# EAGLE design main (EAGLE 7.1.0)
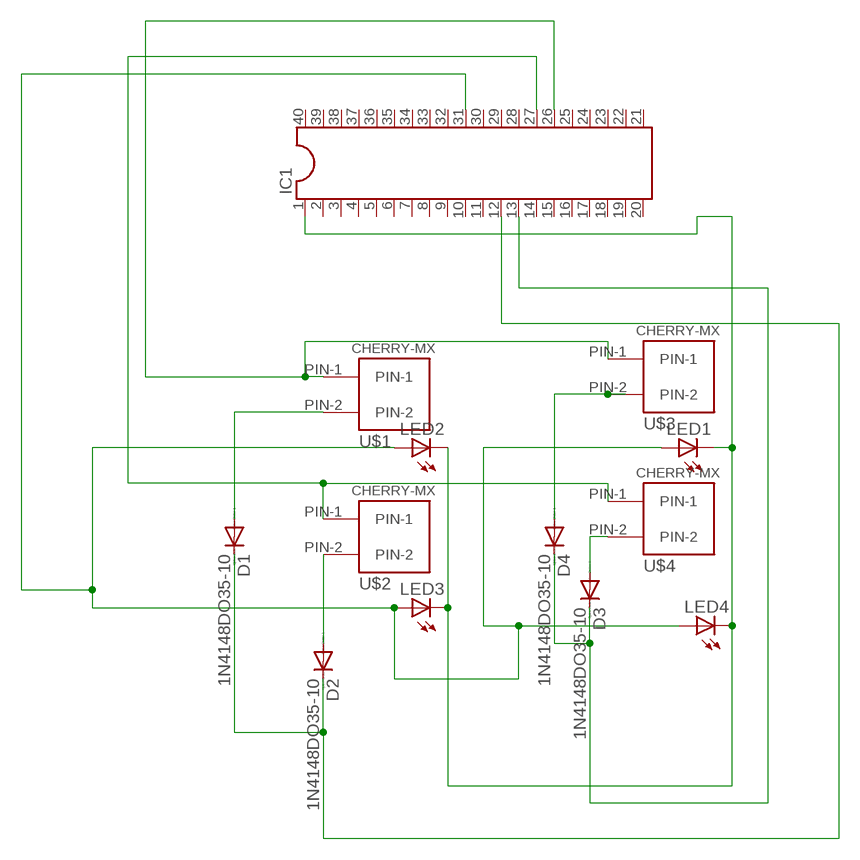
[diagram p0: schematic, sheet 1]

## Parts
D1  1N4148DO35-10  [DO35-10]
D2  1N4148DO35-10  [DO35-10]
D3  1N4148DO35-10  [DO35-10]
D4  1N4148DO35-10  [DO35-10]
IC1  DIL40  [DIL40]
LED1  LED3MM  [LED3MM]
LED2  LED3MM  [LED3MM]
LED3  LED3MM  [LED3MM]
LED4  LED3MM  [LED3MM]
U$1  CHERRY-MX-I  [CHERRY-MX-I]
U$2  CHERRY-MX-I  [CHERRY-MX-I]
U$3  CHERRY-MX-I  [CHERRY-MX-I]
U$4  CHERRY-MX-I  [CHERRY-MX-I]

## Nets
N$1: D1.A U$1.PIN-2
N$2: D2.A U$2.PIN-2
N$3: D4.A U$3.PIN-2
N$4: D3.A U$4.PIN-2
N$6: D3.C D4.C IC1.13
N$7: IC1.27 U$2.PIN-1 U$4.PIN-1
N$8: IC1.26 U$1.PIN-1 U$3.PIN-1
N$10: D1.C D2.C IC1.12
N$11: IC1.1 LED1.K(C) LED2.K(C) LED3.K(C) LED4.K(C)
N$12: IC1.31 LED1.A LED2.A LED3.A LED4.A
Unconnected: IC1.2 IC1.3 IC1.4 IC1.5 IC1.6 IC1.7 IC1.8 IC1.9 IC1.10 IC1.11 IC1.14 IC1.15 IC1.16 IC1.17 IC1.18 IC1.19 IC1.20 IC1.21 IC1.22 IC1.23 IC1.24 IC1.25 IC1.28 IC1.29 IC1.30 IC1.32 IC1.33 IC1.34 IC1.35 IC1.36 IC1.37 IC1.38 IC1.39 IC1.40

## Library data of the parts
D1-D4 = diode:1N4148: DIODE high speed (Philips)
IC1 = ic-package:DIL40: Dual In Line
LED1-LED4 = led:LED: LED OSRAM: - CHIPLED LG R971, LG N971, LY N971, LG Q971, LY Q971, LO R971, LY R971 LH N974, LH R974 LS Q976, LO Q976, LY Q976 LO Q996 - Hyper CHIPLED LW Q18S LB Q993, LB Q99A, LB R99A - SideLED LS A670, LO A670, LY A670, LG A670, LP A670 LB A673, LV A673, LT A673, LW A673 LH A674 LY A675 LS A676, LA A676, LO A676, LY A676, LW A676 LS A679, LY A679, LG A679 - Hyper Micro SIDELED® LS Y876, LA Y876, LO Y876, LY Y876 LT Y87S - SmartLED LW L88C, LW L88S LB L89C, LB L89S, LG L890 LS L89K, LO L89K, LY L89K LS L896, LA L896, LO L896, LY L896 - TOPLED LS T670, LO T670, LY T670, LG T670, LP T670 LSG T670, LSP T670, LSY T670, LOP T670, LYG T670 LG T671, LOG T671, LSG T671 LB T673, LV T673, LT T673, LW T673 LH T674 LS T676, LA T676, LO T676, LY T676, LB T676, LH T676, LSB T676, LW T676 LB T67C, LV T67C, LT T67C, LS T67K, LO T67K, LY T67K, LW E67C LS E67B, LA E67B, LO E67B, LY E67B, LB E67C, LV E67C, LT E67C LW T67C LS T679, LY T679, LG T679 LS T770, LO T770, LY T770, LG T770, LP T770 LB T773, LV T773, LT T773, LW T773 LH T774 LS E675, LA E675, LY E675, LS T675 LS T776, LA T776, LO T776, LY T776, LB T776 LHGB T686 LT T68C, LB T68C - Hyper Mini TOPLED® LB M676 - Mini TOPLED Santana® LG M470 LS M47K, LO M47K, LY M47K Source: http://www.osram.convergy.de LUXEON: - LUMILED® LXK2-PW12-R00, LXK2-PW12-S00, LXK2-PW14-U00, LXK2-PW14-V00 LXK2-PM12-R00, LXK2-PM12-S00, LXK2-PM14-U00 LXK2-PE12-Q00, LXK2-PE12-R00, LXK2-PE12-S00, LXK2-PE14-T00, LXK2-PE14-U00 LXK2-PB12-K00, LXK2-PB12-L00, LXK2-PB12-M00, LXK2-PB14-N00, LXK2-PB14-P00, LXK2-PB14-Q00 LXK2-PR12-L00, LXK2-PR12-M00, LXK2-PR14-Q00, LXK2-PR14-R00 LXK2-PD12-Q00, LXK2-PD12-R00, LXK2-PD12-S00 LXK2-PH12-R00, LXK2-PH12-S00 LXK2-PL12-P00, LXK2-PL12-Q00, LXK2-PL12-R00 Source: www.luxeon.com KINGBRIGHT: KA-3528ASYC Source: www.kingbright.com
U$1-U$4 = cherrymx:CHERRY-MX-I

## Board
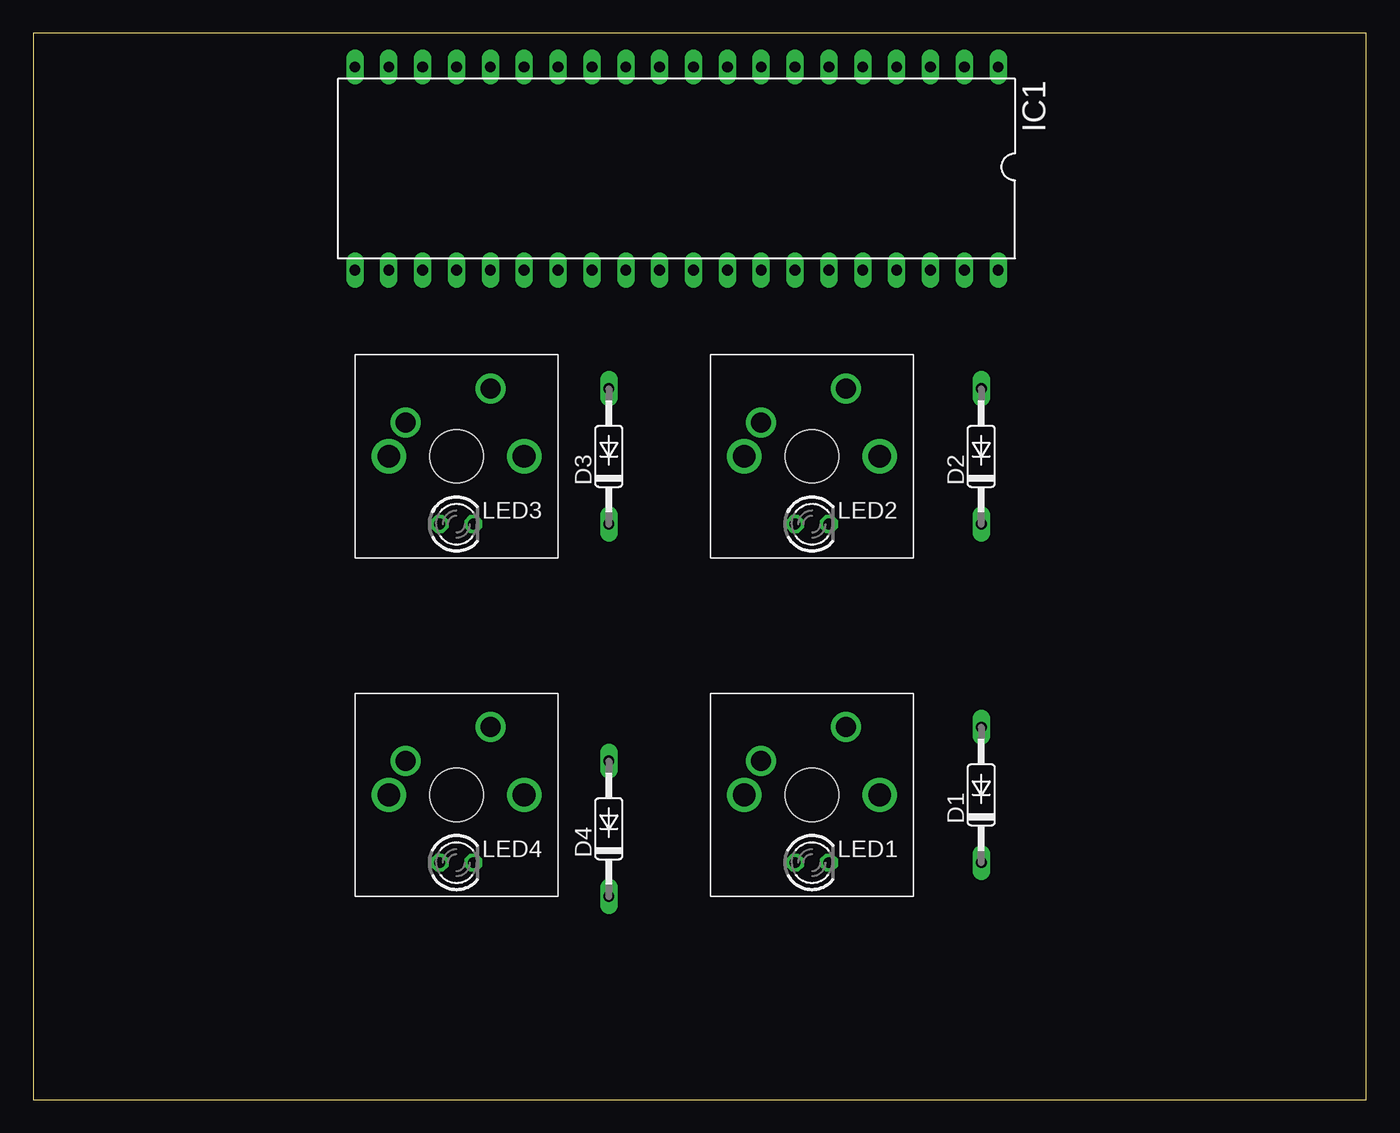
[diagram p1: board, top side]
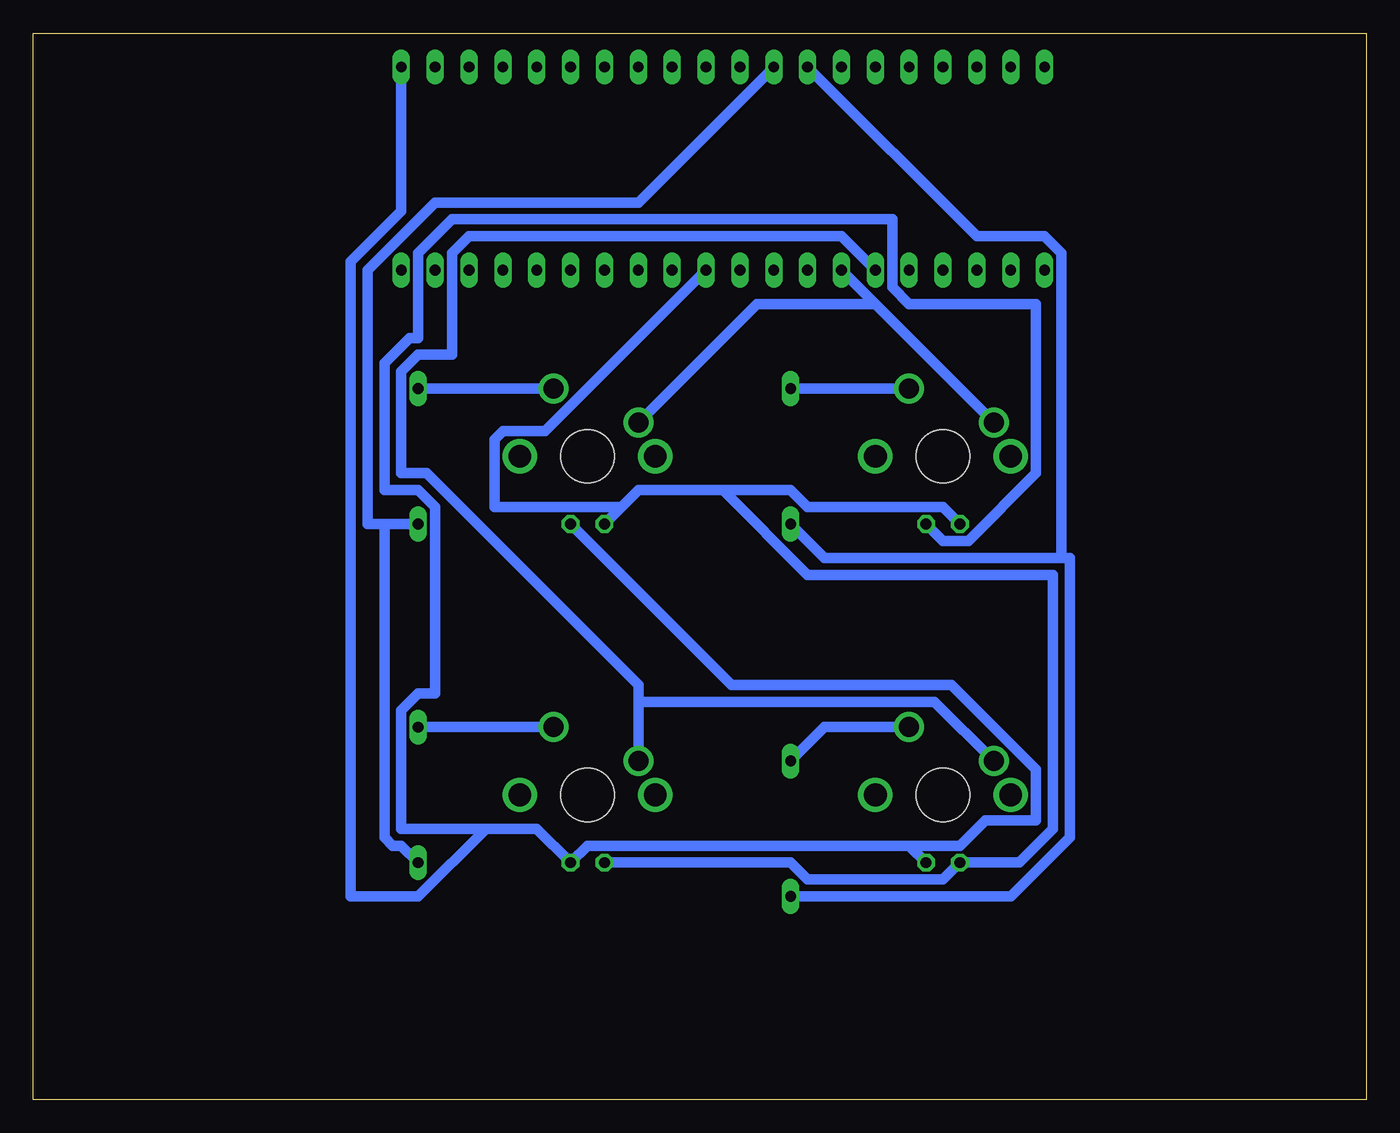
[diagram p2: board, bottom side, seen from below]

Size 100 x 80 mm. Coordinates in mm from the lower left corner, seen from the top.
Outline: 0,0 100,0 100,80 0,80 0,0
Copper layers (1*16): Top 0.035mm / dielectric 1.5mm / Bottom 0.035mm
Design rules "default": minimum track width 10mil, minimum drill 24mil, track to track 8mil, track to pad 8mil, pad to pad 8mil, via to via 8mil, smd to smd 8mil, copper to edge 40mil, drill to drill 8mil, minimum pad ring 10mil, minimum via ring 8mil, stop-mask expansion 4mil, vias tented up to drill 0mil, thermal gap 10mil

### Footprints (pad centres in the part's own frame; a part is rotated, then mirrored left to right if it is on the bottom)
DO35-10 = drill 0.813 long: A 5.08,0; C -5.08,0
DIL40 = drill 0.813 long: 1 -24.13,-7.62; 2 -21.59,-7.62; 3 -19.05,-7.62; 4 -16.51,-7.62; 5 -13.97,-7.62; 6 -11.43,-7.62; 7 -8.89,-7.62; 8 -6.35,-7.62; 9 -3.81,-7.62; 10 -1.27,-7.62; 11 1.27,-7.62; 12 3.81,-7.62; 13 6.35,-7.62; 14 8.89,-7.62; 15 11.43,-7.62; 16 13.97,-7.62; 17 16.51,-7.62; 18 19.05,-7.62; 19 21.59,-7.62; 20 24.13,-7.62; 21 24.13,7.62; 22 21.59,7.62; 23 19.05,7.62; 24 16.51,7.62; 25 13.97,7.62; 26 11.43,7.62; 27 8.89,7.62; 28 6.35,7.62; 29 3.81,7.62; 30 1.27,7.62; 31 -1.27,7.62; 32 -3.81,7.62; 33 -6.35,7.62; 34 -8.89,7.62; 35 -11.43,7.62; 36 -13.97,7.62; 37 -16.51,7.62; 38 -19.05,7.62; 39 -21.59,7.62; 40 -24.13,7.62
LED3MM = drill 0.813 octagon: A -1.27,0; K 1.27,0
CHERRY-MX-I = drill 1.714 pad 1.778: P$3 -5.08,0; P$4 5.08,0 | drill 1.5 pad 2.184: PIN-1 -3.81,2.54; PIN-2 2.54,5.08 | hole 4: 0,0

### Placement (x,y rotation side)
D1  71.12,22.86 90 top
D2  71.12,48.26 90 top
D3  43.18,48.26 90 top
D4  43.18,20.32 90 top
IC1  48.26,69.85 180 top
LED1  58.42,17.78 0 top
LED2  58.42,43.18 0 top
LED3  31.75,43.18 0 top
LED4  31.75,17.78 0 top
U$1  58.42,22.86 0 top
U$2  58.42,48.26 0 top
U$3  31.75,22.86 0 top
U$4  31.75,48.26 0 top

### Tracks (layer width: path | path; a pad name or v marks a point on that pad's centre or on a via)
N$1
  Bottom 0.8: U$1.PIN-2 D1.A
N$2
  Bottom 0.8: U$2.PIN-2 D2.A
N$3
  Bottom 0.8: D4.A 40.64,27.94 U$3.PIN-2
N$4
  Bottom 0.8: U$4.PIN-2 D3.A
N$6
  Bottom 0.8: D4.C 26.67,15.24 22.23,19.68 22.23,40.64 22.86,40.64 | 22.86,40.64 40.64,40.64 D3.C | IC1.13 29.21,64.77 24.13,64.77 22.86,63.5 22.86,40.64
N$7
  Bottom 0.8: U$4.PIN-1 36.83,59.69 | 36.83,59.69 IC1.27 | U$2.PIN-1 45.72,59.69 36.83,59.69
N$8
  Bottom 0.8: IC1.26 39.37,64.77 67.31,64.77 68.58,63.5 68.58,55.88 71.12,55.88 72.39,54.61 72.39,46.99 70.48,46.99 54.61,31.11 54.61,29.84 | U$1.PIN-1 54.61,29.84 | U$3.PIN-1 32.38,29.84 54.61,29.84
N$10
  Bottom 0.8: D1.C 72.39,19.05 73.03,19.05 73.66,19.68 73.66,43.18 | D2.C 73.66,43.18 | IC1.12 54.61,67.31 69.85,67.31 74.93,62.23 74.93,43.18 73.66,43.18
N$11
  Bottom 0.8: 34.29,19.05 LED4.K | 34.29,19.05 58.42,19.05 LED1.K 62.23,20.32 66.04,20.32 | LED3.K 31.75,41.91 29.84,41.91 24.77,46.99 24.77,59.69 34.29,59.69 35.56,60.96 35.56,66.04 68.58,66.04 71.12,63.5 71.12,57.15 71.75,57.15 73.66,55.24 73.66,45.72 71.12,45.72 69.85,44.45 69.85,30.48 71.12,30.48 72.39,29.21 72.39,20.32 66.04,20.32 | LED2.K 47.62,31.11 31.11,31.11 24.77,24.77 24.77,20.95 28.57,20.95 30.48,19.05 34.29,19.05 | IC1.1 72.39,66.67 76.2,62.87 76.2,15.24 71.12,15.24 66.04,20.32
N$12
  Bottom 0.8: LED1.A 43.18,17.78 41.91,16.51 31.75,16.51 LED4.A 26.04,17.78 23.5,20.32 23.5,39.37 41.91,39.37 48.26,45.72 | LED3.A 31.75,44.45 41.91,44.45 43.18,45.72 48.26,45.72 | 48.26,45.72 54.61,45.72 55.88,44.45 | LED2.A 55.88,44.45 | IC1.31 61.59,50.16 64.77,50.16 65.41,49.53 65.41,44.45 55.88,44.45